# Altium schematic sheet RIO_MCU.SchDoc
size Letter; Organization: Altium Limited; Address1: L3, 12a Rodborough Rd; Address2: Frenchs Forest; Address3: NSW; Address4: Australia 2086
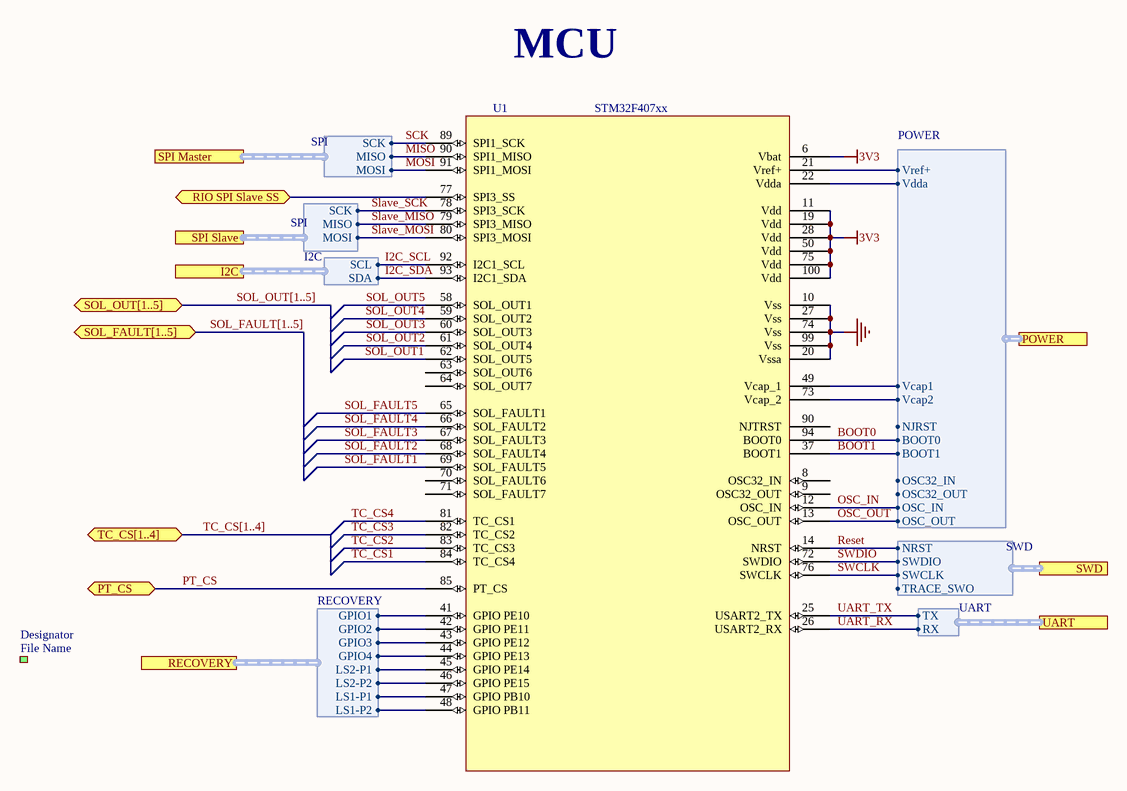
[diagram p0: RIO_MCU.SchDoc]

## Parts
U1  STM32F407xx  [LQFP100]

## Sub-sheets
Designator = File Name: no entries

## Ports
I2C (harness I2C), POWER (harness POWER), PT_CS (bidir), RECOVERY (harness RECOVERY), RIO SPI Slave SS (bidir), SOL_FAULT[1..5] (bidir), SOL_OUT[1..5] (bidir), SPI Master (harness SPI), SPI Slave (harness SPI), SWD (harness SWD), TC_CS[1..4] (bidir), UART (harness UART)

## Harnesses
I2C: SCL, SDA
SWD: NRST, SWDIO, SWCLK, TRACE_SWO
POWER: Vdda, Vref+, Vcap1, Vcap2, NJRST, BOOT0, BOOT1, OSC32_IN, OSC32_OUT, OSC_IN, OSC_OUT
SPI: SCK, MISO, MOSI
SPI: MISO, MOSI, SCK
UART: RX, TX
RECOVERY: GPIO1, GPIO2, GPIO3, GPIO4, LS1-P1, LS1-P2, LS2-P1, LS2-P2

## Nets
3V3: U1.6(Vbat) U1.11(Vdd) U1.19(Vdd) U1.28(Vdd) U1.50(Vdd) U1.75(Vdd) U1.100(Vdd)
GND: U1.10(Vss) U1.20(Vssa) U1.27(Vss) U1.74(Vss) U1.99(Vss)
BOOT0: U1.94(BOOT0) ; port POWER.BOOT0
BOOT1: U1.37(BOOT1) ; port POWER.BOOT1
I2C_SCL: U1.92(I2C1_SCL) ; port I2C.SCL
I2C_SDA: U1.93(I2C1_SDA) ; port I2C.SDA
MISO: U1.90(NJTRST) ; port SPI Master.MISO
MOSI: U1.91(SPI1_MOSI) ; port SPI Master.MOSI
OSC_IN: U1.12(OSC_IN) ; port POWER.OSC_IN
OSC_OUT: U1.13(OSC_OUT) ; port POWER.OSC_OUT
PT_CS: U1.85(PT_CS) ; port PT_CS
Reset: U1.14(NRST) ; port SWD.NRST
RIO SPI Slave SS: U1.77(SPI3_SS) ; port RIO SPI Slave SS
SCK: U1.89(SPI1_SCK) ; port SPI Master.SCK
Slave_MISO: U1.79(SPI3_MISO) ; port SPI Slave.MISO
Slave_MOSI: U1.80(SPI3_MOSI) ; port SPI Slave.MOSI
Slave_SCK: U1.78(SPI3_SCK) ; port SPI Slave.SCK
SOL_FAULT1: U1.69(SOL_FAULT5)
SOL_FAULT2: U1.68(SOL_FAULT4)
SOL_FAULT3: U1.67(SOL_FAULT3)
SOL_FAULT4: U1.66(SOL_FAULT2)
SOL_FAULT5: U1.65(SOL_FAULT1)
SOL_OUT1: U1.62(SOL_OUT5)
SOL_OUT2: U1.61(SOL_OUT4)
SOL_OUT3: U1.60(SOL_OUT3)
SOL_OUT4: U1.59(SOL_OUT2)
SOL_OUT5: U1.58(SOL_OUT1)
SWCLK: U1.76(SWCLK) ; port SWD.SWCLK
SWDIO: U1.72(SWDIO) ; port SWD.SWDIO
TC_CS1: U1.84(TC_CS4)
TC_CS2: U1.83(TC_CS3)
TC_CS3: U1.82(TC_CS2)
TC_CS4: U1.81(TC_CS1)
UART_RX: U1.26(USART2_RX) ; port UART.RX
UART_TX: U1.25(USART2_TX) ; port UART.TX
NetU1_21: U1.21(Vref+) ; port POWER.Vref+
NetU1_22: U1.22(Vdda) ; port POWER.Vdda
NetU1_41: U1.41(GPIO_PE10) ; port RECOVERY.GPIO1
NetU1_42: U1.42(GPIO_PE11) ; port RECOVERY.GPIO2
NetU1_43: U1.43(GPIO_PE12) ; port RECOVERY.GPIO3
NetU1_44: U1.44(GPIO_PE13) ; port RECOVERY.GPIO4
NetU1_45: U1.45(GPIO_PE14) ; port RECOVERY.LS2-P1
NetU1_46: U1.46(GPIO_PE15) ; port RECOVERY.LS2-P2
NetU1_47: U1.47(GPIO_PB10) ; port RECOVERY.LS1-P1
NetU1_48: U1.48(GPIO_PB11) ; port RECOVERY.LS1-P2
NetU1_49: U1.49(Vcap_1) ; port POWER.Vcap1
NetU1_73: U1.73(Vcap_2) ; port POWER.Vcap2

Not connected (* = marked no-connect by the designer): U1 8(OSC32_IN) 9(OSC32_OUT) 63(SOL_OUT6) 64(SOL_OUT7) 70(SOL_FAULT6) 71(SOL_FAULT7)

## Buses and harness runs
bus SOL_FAULT[1..5] = port SOL_FAULT[1..5]
bus SOL_OUT[1..5] = port SOL_OUT[1..5]
bus TC_CS[1..4] = port TC_CS[1..4]

## Notes on the sheet
- MCU
- Title
- Size:
- Date:
- Letter
- Number:
- Time:
- Revision:
- Sheet
- of
- File: